# Altium schematic sheet Power.SchDoc: Power
size A3; DrawnBy: Mogens Groth Nicolaisen; DocumentNumber: 5; SheetNumber: 5; SheetTotal: 7
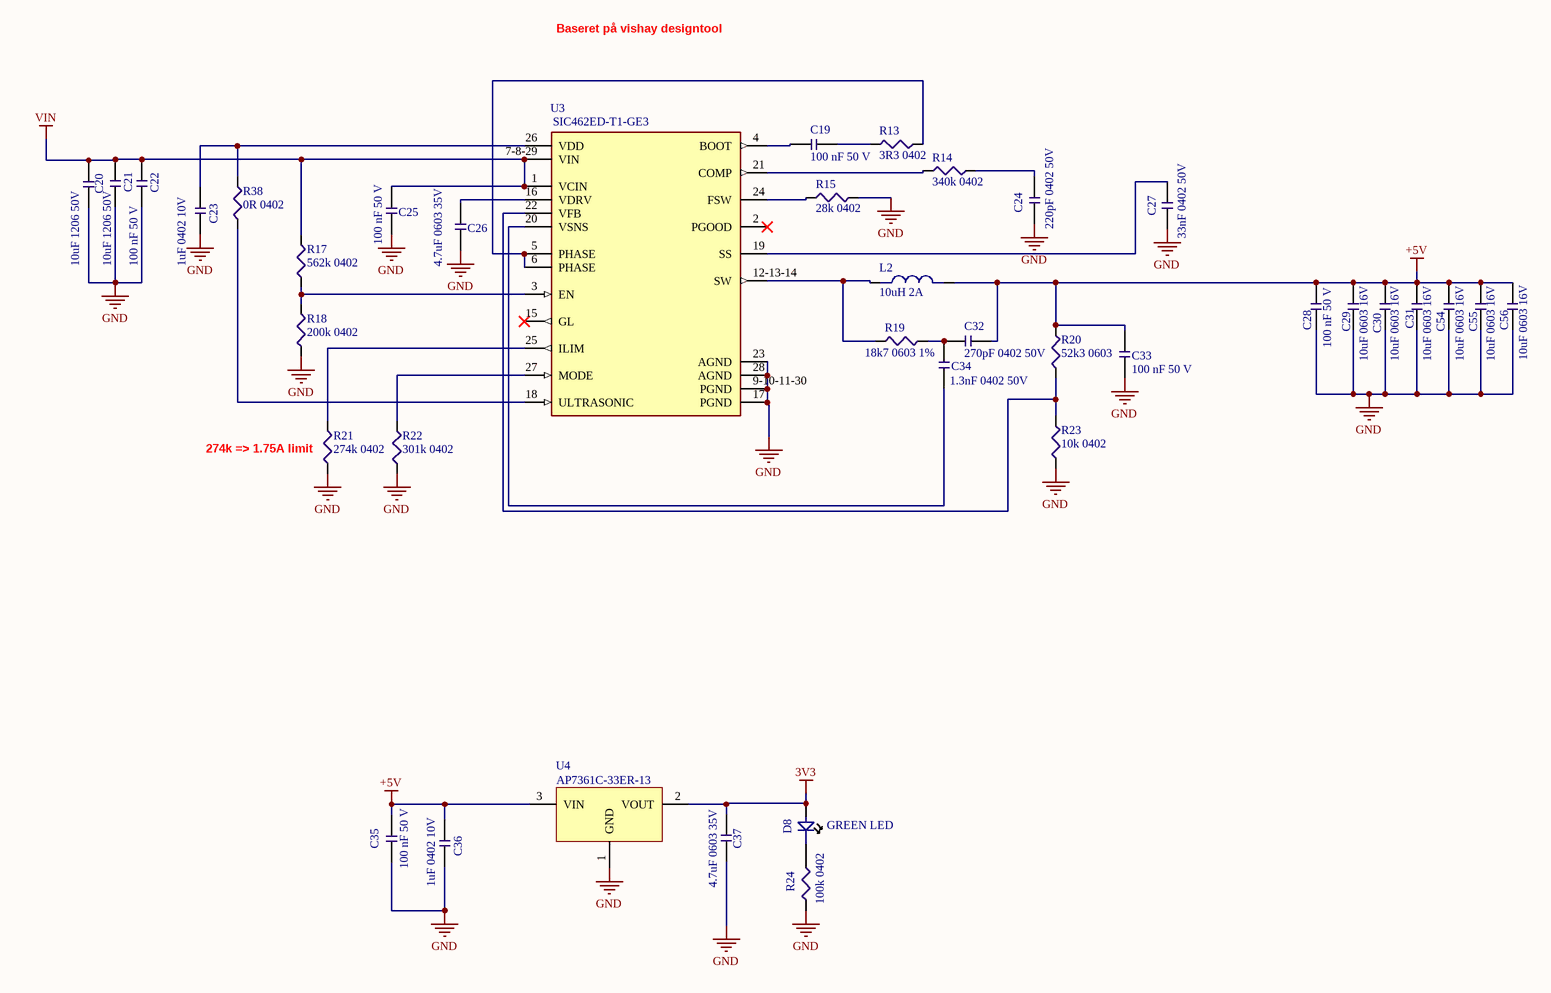
[diagram p0: Power.SchDoc]

## Parts
C19  100 nF 50 V  [CAP_0402]
C20  10uF 1206 50V  [CAP_1206]
C21  10uF 1206 50V  [CAP_1206]
C22  100 nF 50 V  [CAP_0402]
C23  1uF 0402 10V  [CAP_0402]
C24  220pF 0402 50V  [CAP_0402]
C25  100 nF 50 V  [CAP_0402]
C26  4.7uF 0603 35V  [CAP_0603]
C27  33nF 0402 50V  [CAP_0402]
C28  100 nF 50 V  [CAP_0402]
C29  10uF 0603 16V  [CAP_0603]
C30  10uF 0603 16V  [CAP_0603]
C31  10uF 0603 16V  [CAP_0603]
C32  270pF 0402 50V  [CAP_0402]
C33  100 nF 50 V  [CAP_0402]
C34  1.3nF 0402 50V  [CAP_0402]
C35  100 nF 50 V  [CAP_0402]
C36  1uF 0402 10V  [CAP_0402]
C37  4.7uF 0603 35V  [CAP_0603]
C54  10uF 0603 16V  [CAP_0603]
C55  10uF 0603 16V  [CAP_0603]
C56  10uF 0603 16V  [CAP_0603]
D8  GREEN LED  [0402 LED]
L2  10uH 2A  [FP-NR5040-H_4_1-MFG]
R13  3R3 0402  [RES_0402]
R14  340k 0402  [RES_0402]
R15  28k 0402  [RES_0402]
R17  562k 0402  [RES_0402]
R18  200k 0402  [RES_0402]
R19  18k7 0603 1%  [RES_0603]
R20  52k3 0603  [RES_0603]
R21  274k 0402  [RES_0402]
R22  301k 0402  [RES_0402]
R23  10k 0402  [RES_0402]
R24  100k 0402  [RES_0402]
R38  0R 0402  [RES_0402]
U3  SIC462ED-T1-GE3  [FP-T18-0594-MFG]
U4  AP7361C-33ER-13  [SOT230P700X180-4N]

## Nets
3V3: C37.2 D8.1 U4.2(VOUT)
+5V: C28.2 C29.2 C30.2 C31.2 C32.2 C33.2 C35.2 C36.2 C54.2 C55.2 C56.2 L2.2 R20.2 U4.3(VIN)
GND: C20.2 C21.2 C22.1 C23.1 C24.1 C25.1 C26.1 C27.1 C28.1 C29.1 C30.1 C31.1 C33.1 C35.1 C36.1 C37.1 C54.1 C55.1 C56.1 R15.2 R18.1 R21.1 R22.1 R23.1 R24.1 U3.9-10-11-30(PGND) U3.17(PGND) U3.23(AGND) U3.28(AGND) U4.1(GND)
VIN: C20.1 C21.1 C22.2 C25.2 R17.2 U3.1(VCIN) U3.7-8-29(VIN)
NetC19_1: C19.1 U3.4(BOOT)
NetC19_2: C19.2 R13.1
NetC23_2: C23.2 R38.2 U3.26(VDD)
NetC24_2: C24.2 R14.2
NetC26_2: C26.2 U3.16(VDRV)
NetC27_2: C27.2 U3.19(SS)
NetC32_1: C32.1 C34.2 R19.2
NetC34_1: C34.1 U3.20(VSNS)
NetD8_2: D8.2 R24.2
NetL2_1: L2.1 R19.1 U3.12-13-14(SW)
NetR13_2: R13.2 U3.5(PHASE) U3.6(PHASE)
NetR14_1: R14.1 U3.21(COMP)
NetR15_1: R15.1 U3.24(FSW)
NetR17_1: R17.1 R18.2 U3.3(EN)
NetR20_1: R20.1 R23.2 U3.22(VFB)
NetR21_2: R21.2 U3.25(ILIM)
NetR22_2: R22.2 U3.27(MODE)
NetR38_1: R38.1 U3.18(ULTRASONIC)

Not connected (* = marked no-connect by the designer): U3 2(PGOOD)* 15(GL)*

## Notes on the sheet
- Baseret på vishay designtool
- 274k => 1.75A limit
- ON Development
- Title:
- Size:
- A3
- Drawn By:
- Date:
- Sheet
- of
- Revision:

## Library data of the parts
C19 C22 C25 C28 C33 C35 = CMP-00088-2: Multilayer Ceramic Capacitors MLCC - SMD/SMT .1uF 50Volts X7R +/-10% 0402 STD; Tolerance: 10%; Value: 100nF; Voltage: 50 V; Voltage Rating: 50V; Mount: Surface Mount; Case/Package: 0402; Case Code (Imperial): 0402; Case Code (Metric): 1005; Min Operating Temperature: -55°C; Max Operating Temperature: 125°C; Capacitance: 100nF; Voltage Rating (DC): 50V; Packaging: Tape and Reel; Package Quantity: 10000; Dielectric: X7R; Termination: SMD/SMT; Length: 0.039inch; Height: 0.5mm; Width: 0.5mm; Thickness: 0.022inch; Lead Free: Lead Free; Halogen Free: Halogen Free
C20 C21 = CMP-00030-4: 10uF 1206 50V X5R 20%; Tolerance: +/- 20%; Value: 10uF; Voltage: 50 V
C23 C36 = CMP-00032-5: 1uF 0402 10V 10% X5R; Material: Ceramic; Tolerance: 10%; Value: 1 uF; Voltage: 10 V; Capacitance: 1uF; Case/Package: 0402; Case Code (Imperial): 0402; Case Code (Metric): 1005; Contact Plating: Tin; Depth: 0.5mm; Dielectric: X5R; Height: 0.5mm; Length: 1mm; Max Operating Temperature: 85°C; Min Operating Temperature: -55°C; Mount: Surface Mount; Package Quantity: 1; Packaging: Tape and Reel; Radiation Hardening: No; Thickness: 0.022inch; Voltage Rating: 10V; Width: 0.02inch
C24 = CMP-00170-1: 220pF 0402 50V 5%; Mfg. Part Number: CL05C221JB5NNNC; Tolerance: 5%; Value: 220pF; Voltage: 50V
C26 C37 = CMP-00134-0.1: CAPACITOR CERAMIC, 4.7UF, 35V, X5R, 10%, 0603; Capacitance: 4.7µF; Capacitance Tolerance: ± 10%; Dielectric...; Tolerance: 10%; Capacitance: 4.7uF; Case/Package: 0603; Case Code (Imperial): 0603; Case Code (Metric): 1608; Max Operating Temperature: 85°C; Min Operating Temperature: -55°C; Packaging: Tape and Reel; Series: C; Termination: SMD/SMT; Voltage Rating: 35V
C27 = CMP-00171-2: 33nF 0402 50V X7R 10%; Manufacturer part no.: GRM155R61H333KE14D; Tolerance: 10%; Value: 33nF; Voltage: 50V
C29-C31 C54-C56 = CMP-00120-1: CAP CER 10UF 16V X5R 0603; Tolerance: 10%; Value: 10uF; Voltage: 16V; Mount: Surface Mount; Case/Package: 0603; Weight: 0.000222oz; Case Code (Metric): 1608; Case Code (Imperial): 0603; Min Operating Temperature: -55°C; Max Operating Temperature: 85°C; Capacitance: 10uF; Packaging: Tape and Reel; Voltage Rating: 16V; Dielectric: X5R; Termination: SMD/SMT; Composition: Ceramic; Voltage Rating (DC): 16V; Package Quantity: 4000; Length: 0.063inch; Height: 0.8mm; Width: 0.8mm; Thickness: 0.037inch; REACH SVHC: No SVHC; Lead Free: Lead Free
C32 = CMP-00175-1: Multilayer Ceramic Capacitors MLCC - SMD/SMT Midhigh 0402 C0G 50V 270pF 5%; Mfg. Part Number: UMK105CG271JV-F; Tolerance: 5%; Value: 270pF; Voltage: 50V
C34 = CMP-00174-1: Cap Ceramic 0.0013uF 50V C0G 5% SMD 0402 125°C Paper T/R; Manufacturer Part no.: C0402C132J5GAC7867; Tolerance: 10%; Value: 1.3nF; Voltage: 50V
D8 = CMP-008-0001-2: 0402 SMD LED; Mfg. Part Number: LTST-C281KGKT
L2 = CMP-007-0013-1: Inductor Power Shielded Wirewound 10uH 20% 100KHz Ferrite 2.1A 0.0728Ohm DCR T/R; Mfg. Part No: NRS5040T100MMGJ; Current: 2.2A; Value: 10 uH; Case/Package: Nonstandard
R13 = CMP-001-0062-1: RES SMD 3R3 OHM 1% 1/16W 0402; Mfg. Part Number: CRGCQ0402J3R3; Tolerance: 5%; Case/Package: 0402; Power: 1/16 W; Value: 3R3
R14 = CMP-001-0058-1: RES SMD 340K OHM 1% 1/16W 0402; Mfg. Part Number: RC0402FR-07340KL; Case/Package: 0402; Power: 1/16 W; Tolerance: 1%; Value: 340k
R15 = CMP-0001-00014-1: 28K 0402 1% 1/16W; Resistance: 28kR; Max Power Dissipation: 63mW; Temperature Coefficient: 100ppm/°C; Case/Package: 0402; Power: 1/16W; Tolerance: 1%; Value: 28K; Mount: Surface Mount; Case Code (Metric): 1005; Case Code (Imperial): 0402; Contact Plating: Tin, Matte; Min Operating Temperature: -55°C; Max Operating Temperature: 155°C; Packaging: Tape and Reel; Composition: Thick Film; Number of Terminations: 2; Features: Automotive AEC-Q200; Length: 0.039inch; Height: 0.016inch; Width: 0.02inch; Radiation Hardening: No; Lead Free: Lead Free
R17 = CMP-001-0061-1: RES SMD 562K OHM 1% 1/16W 0402; Mfg. Part Number: RMCF0402FT562K; Case/Package: 0402; Power: 1/16 W; Tolerance: 1%; Value: 562k
R18 = CMP-001-0060-1: RES SMD 200K OHM 1% 1/16W 0402; Mfg. Part Number: RC1005F204CS; Case/Package: 0402; Power: 1/16 W; Tolerance: 1%; Value: 200k
R19 = CMP-001-0068-1: Res Thick Film 0603 18.7K Ohm 1% 1/10W ±100ppm/°C Molded SMD SMD Paper T/R; Manufacturer part no.: RMCF0603FT18K7; Case/Package: 0603; Tolerance: 1%; Value: 18k7
R20 = CMP-001-0064-2: Res Thick Film 0603 52.3K Ohm 1% 0.1W(1/10W) ±100ppm/C Epoxy SMD T/R; Manufacturer Part no.: RC0603FR-0752K3L; Value: 52.6k; Case/Package: 0603; Power: 1/10W; Tolerance: 1%
R21 = CMP-001-0066-1: Res Thick Film 0402 274K Ohm 1% 0.063W ±100ppm/°C Molded SMD Paper T/R; Mfg. Part Number: RMCF0402FT274K; Power: 63mW; Case/Package: 0402; Tolerance: 1%; Value: 274k
R22 = CMP-0001-00033-1: 301K 1% 0402; Manufacturer part no.: RMCF0402FT301K; Value: 301kOhm; Case/Package: 0402; Tolerance: 1%
R23 = CMP-001-0019-3: RES SMD 10K OHM 1% 1/16W 0402; Mfg. Part Number: RMCF0402FT10K0; Case/Package: 0402; Power: 1/16 W; Tolerance: 1 %; Value: 10k
R24 = CMP-00123-1: Res General Purpose Thick Film 0402 100K Ohm 1% 1/16W ±100ppm/°C Molded SMD Paper T/R; Mfg. Part Number: RC0402FR-07100KL; Voltage: 50V; Power Rating: 63mW; Resistance: 100kR; Tolerance: 1%; Value: 100k; Case/Package: 0402; Case Code (Metric): 1005; Case Code (Imperial): 0402; Min Operating Temperature: -55°C; Max Operating Temperature: 155°C; Voltage Rating: 50V; Package Quantity: 1; Packaging: Tape and Reel; Composition: Thick Film; Number of Terminations: 2; Termination: SMD/SMT; Temperature Coefficient: 100ppm/°C; Military Standard: Not; Max Power Dissipation: 63mW; Working Voltage: 50V; Features: Moisture Resistant; Length: 0.039inch; Height: 0.016inch; Width: 0.02inch; Depth: 0.5mm; REACH SVHC: No SVHC; Lead Free: Lead Free
R38 = CMP-001-0055-1: RES SMD 0 OHM 1/16W 0402; Mfg. Part Number: RC0402JR-070RL; Power: 63mW; Case/Package: 0402; Tolerance: -; Value: 0R
U3 = CMP-00167-1: SiC462 Series 60 V 6 A Synchronous Buck Regulator - PowerPAK® MLP55-27; manufacturer part no.: SIC462ED-T1-GE3
U4 = CMP-00179-1: 1A Low Dropout 3V3; Mount: SMD; Case/Package: SOT223R; Manufacturer Part No.:: AP7361C-33ER-13; Pins: 4; RoHS: Yes